# Altium schematic sheet Power.SchDoc
size A4; SheetNumber: 2; SheetTotal: 8
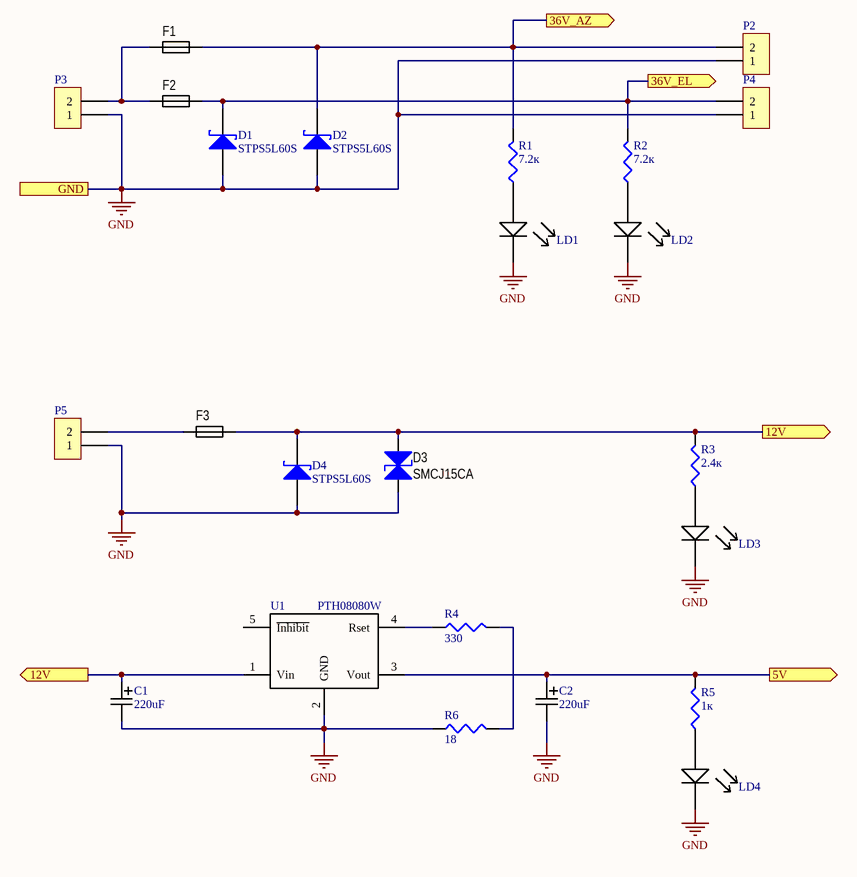
[diagram p0: Power.SchDoc]

## Parts
C1  220uF  [ECAP SMD 8x10.5]
C2  220uF  [ECAP SMD 8x10.5]
D1  STPS5L60S  [SMCJ]
D2  STPS5L60S  [SMCJ]
D3  SMCJ15CA  [SMCJ_CA]
D4  STPS5L60S  [SMCJ]
F1  FH-101C  [FH-101C]  (value not drawn)
F2  FH-101C  [FH-101C]  (value not drawn)
F3  FH-101C  [FH-101C]  (value not drawn)
LD1  GNL-3012ED  [LED 3mm]  (value not drawn)
LD2  GNL-3012ED  [LED 3mm]  (value not drawn)
LD3  GNL-3012ED  [LED 3mm]  (value not drawn)
LD4  GNL-3012ED  [LED 3mm]  (value not drawn)
P2  2EDGR-5.0-02P  [2EDGR-5.0-02P]  (value not drawn)
P3  2EDGR-5.0-02P  [2EDGR-5.0-02P]  (value not drawn)
P4  2EDGR-5.0-02P  [2EDGR-5.0-02P]  (value not drawn)
P5  15EDGRC-3.81-02  [15EDGRC-3.81-02]  (value not drawn)
R1  7.2к  [R1608-0603]
R2  7.2к  [R1608-0603]
R3  2.4к  [R1608-0603]
R4  330  [R1608-0603]
R5  1к  [R1608-0603]
R6  18  [R1608-0603]
U1  PTH08080W  [PTH08080W]

## Ports
5V (out), 12V (out), 36V_AZ (out), 36V_EL (out), GND

## Nets
GND: C1.2 C2.2 D1.2(A) D2.2(A) D3.1(K) D4.2(A) LD1.1(K) LD2.1(K) LD3.1(K) LD4.1(K) P2.1 P3.1 P4.1 P5.1 R6.1 U1.2(GND) ; port GND
5V: C2.1 R5.2 U1.3(Vout) ; port 5V
12V: C1.1 D3.2(A) D4.1(K) F3.2 R3.2 U1.1(Vin) ; port 12V
36V_AZ: D2.1(K) F1.2 P2.2 R1.2 ; port 36V_AZ
36V_EL: D1.1(K) F2.2 P4.2 R2.2 ; port 36V_EL
NetF1_1: F1.1 F2.1 P3.2
NetF3_1: F3.1 P5.2
NetLD1_2: LD1.2(A) R1.1
NetLD2_2: LD2.2(A) R2.1
NetLD3_2: LD3.2(A) R3.1
NetLD4_2: LD4.2(A) R5.1
NetR4_1: R4.1 U1.4(Rset)
NetR4_2: R4.2 R6.2

Not connected (* = marked no-connect by the designer): U1 5(~{Inhibit})

## Library data of the parts
C1 C2 = ECAP SMD: Конденсатор электролитический алюминиевый SMD 8x10.5мм; Производитель: JB Capacitors; Напряжение: 25B; Температурный диапазон: -40 ~ 105; Название: ECAP SMD; Номинал: 220uF; Диэлектрик: Электролит; Вид монтажа: SMD; Тип элемента: Конденсатор электролитический
D1 D2 D4 = STPS5L60S: Диод Шоттки 60В 5А [SMC]; Производитель: STMicroelectronics; Корпус: do-214ab/smc; Вид монтажа: SMD; Название: STPS5L60S; Артикул: STPS5L60S; Напряжение: 60В; Тип элемента: Диод шоттки
D3 = SMCJ_CА: Супрессор двунаправленный; Производитель: ST MICROELECTRONICS CO., LTD.; Корпус: DO-214AB, SMC; Номинал: 15В; Вид монтажа: SMD; Тип элемента: Защитный диод; Температурный диапазон: -55°C ~ 150°C; Название: SMCJ15CA; Артикул: SMCJ15CA; ComponentLink: http://www.digikey.com/product-detail/en/SMBJ5.0CA/SMBJ5.0CABTR-ND/2254207
F1 F2 = FH-101C: Держатель предохранителя 5x20 с крышкой; Производитель: Dragon City Industries; Номинал: 5А; Вид монтажа: DIP; Температурный диапазон: -40…85; Название: FH-101C; Артикул: FH-101C; Корпус: 5x20; Тип элемента: держатель предохранителя
F3 = FH-101C: Держатель предохранителя 5x20 с крышкой; Производитель: Dragon City Industries; Номинал: 0.75А; Вид монтажа: DIP; Температурный диапазон: -40…85; Название: FH-101C; Артикул: FH-101C; Корпус: 5x20; Тип элемента: держатель предохранителя
LD1-LD4 = GNL-3012ED: Светодиод красный 3мм; Производитель: STMicroelectronics; Вид монтажа: DIP; Название: GNL-3012ED; Артикул: GNL-3012ED; Тип элемента: Светодиод
P2-P4 = 2EDGR-5.0-02P: Разъем штыревой на плату (папа); Производитель: Degson; Номинал: 10А; Напряжение: 300В; Вид монтажа: DIP; Температурный диапазон: -40℃~105℃; Примечание: шаг 5 мм; Название: 2EDGR-5.0-02P; Артикул: 2EDGR-5.0-02P; Тип элемента: Разъем
P5 = 15EDGRC-3.81-02: Разъем штыревой на плату (папа); Производитель: Degson; Номинал: 8А; Напряжение: 300В; Вид монтажа: DIP; Температурный диапазон: -40℃~105℃; Примечание: шаг 3.81 мм; Название: 15EDGRC-3.81-02; Артикул: 15EDGRC-3.81-02; Тип элемента: Разъем
R1-R6 = resistor: SMD резистор; Производитель: 1%; Корпус: 0603 (1608 Metric); Точность: 1%; Название: Резистор; Вид монтажа: SMD; Тип элемента: Резистор
  R1 R2: Номинал: 7.2к
  R3: Номинал: 2.4к
  R4: Номинал: 330
  R5: Номинал: 1к
  R6: Номинал: 18
U1 = PTH08080W: DC/DC преобразователь; Производитель: Texas Instruments; Номинал: 2.25А; Напряжение: 18/0.9-5.5В; Вид монтажа: DIP; Тип элемента: Модуль питания; Температурный диапазон: -40°C ~ 85°C; Название: PTH08080W; ComponentLink: http://www.digikey.com/product-detail/en/AD22100STZ/AD22100STZ-ND/936657; Артикул: PTH08080W